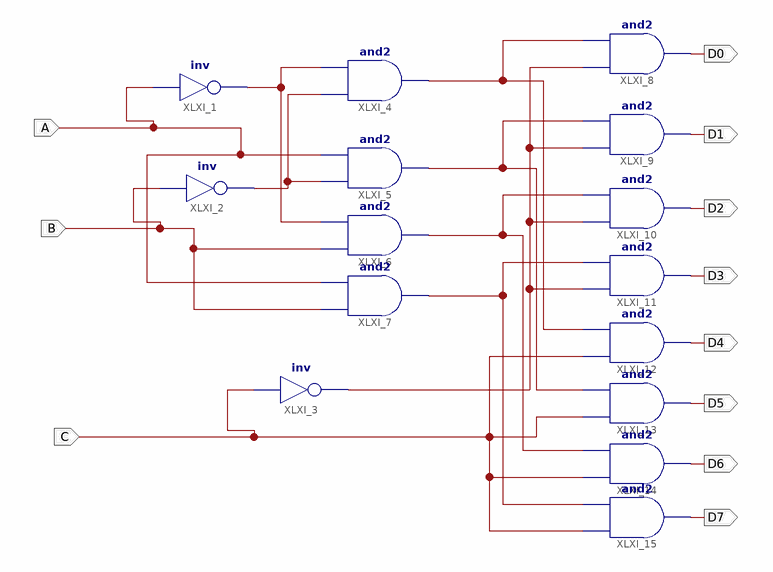
[diagram p0: schematic sheet 1]
// Xilinx ISE schematic Decoder_38_sch.sch (kintex7) as structural Verilog: 15 symbols, 11 ports
module Decoder_38_sch (
  input  A,
  input  B,
  input  C,
  output D0,
  output D1,
  output D2,
  output D3,
  output D4,
  output D5,
  output D6,
  output D7
);

  wire XLXN_9, XLXN_10, XLXN_15, XLXN_16, XLXN_17, XLXN_18, XLXN_22;

  not XLXI_1 (XLXN_9, A);
  not XLXI_2 (XLXN_10, B);
  not XLXI_3 (XLXN_22, C);
  and XLXI_4 (XLXN_15, XLXN_10, XLXN_9);
  and XLXI_5 (XLXN_16, XLXN_10, A);
  and XLXI_6 (XLXN_17, B, XLXN_9);
  and XLXI_7 (XLXN_18, B, A);
  and XLXI_8 (D0, XLXN_22, XLXN_15);
  and XLXI_9 (D1, XLXN_22, XLXN_16);
  and XLXI_10 (D2, XLXN_22, XLXN_17);
  and XLXI_11 (D3, XLXN_22, XLXN_18);
  and XLXI_12 (D4, C, XLXN_15);
  and XLXI_13 (D5, C, XLXN_16);
  and XLXI_14 (D6, C, XLXN_17);
  and XLXI_15 (D7, C, XLXN_18);
endmodule
